# Altium schematic sheet level shifter.SchDoc
size 594 x 420 mm
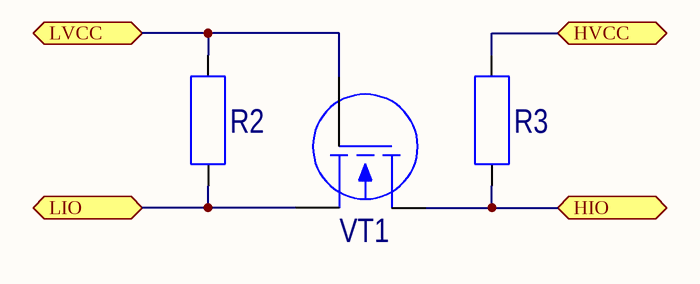
[diagram p0: level shifter.SchDoc]

## Parts
R2  10K0603  [RESC1608X06N/0603]  (value not drawn)
R3  10K0603  [RESC1608X06N/0603]  (value not drawn)
VT1  IRLML6244TRPBF  [TP-236 (SOT23)]  (value not drawn)

## Ports
HIO, HVCC, LIO, LVCC

## Nets
HIO: R3.1 VT1.3 ; port HIO
HVCC: R3.2 ; port HVCC
LIO: R2.1 VT1.2 ; port LIO
LVCC: R2.2 VT1.1 ; port LVCC

## Notes on the sheet
- Перв. примен.
- Справ. №
- Подп. и дата
- Инв. № дубл.
- Взам. инв. №
- Разраб.
- Изм.
- Лист
- № докум.
- Подп.
- Дата
- Лит.
- Масса
- Масштаб
- Пров.
- Т.контр.
- Листов
- Инв. № подл.
- Утв.
- Н.контр.
- Копировал
- Формат А2

## Library data of the parts
R2 R3 = 10K0603: RES SMD 10K OHM 1% 1/8W 0603; Manufacturer Part Number: MCT06030C1002FP500; Manufacturer: Vishay Beyschlag; Power (Watts): 0.125W, 1/8W; Tolerance: ±1%; Resistance (Ohms): 10K
VT1 = IRLML6244TRPBF: MOSFET N-CH 20V 6.3A SOT-23; Manufacturer: Infineon Technologies; Manufacturer Part Number: IRLML6244TRPBF